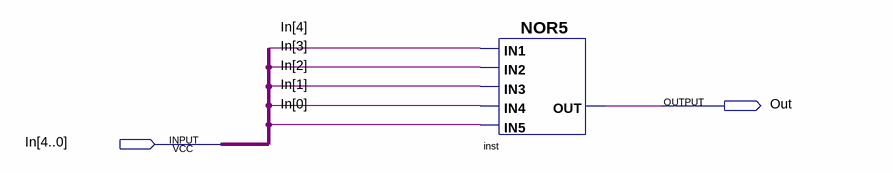
[diagram p0: schematic sheet]
// Quartus schematic NOR_5.bdf as structural Verilog: 1 symbols, 2 pins
module NOR_5 (
  input  [4:0] In,
  output Out
);

  nor inst (Out, In[4], In[3], In[2], In[1], In[0]);
endmodule
